# Altium schematic sheet PCB.SchDoc
size A4
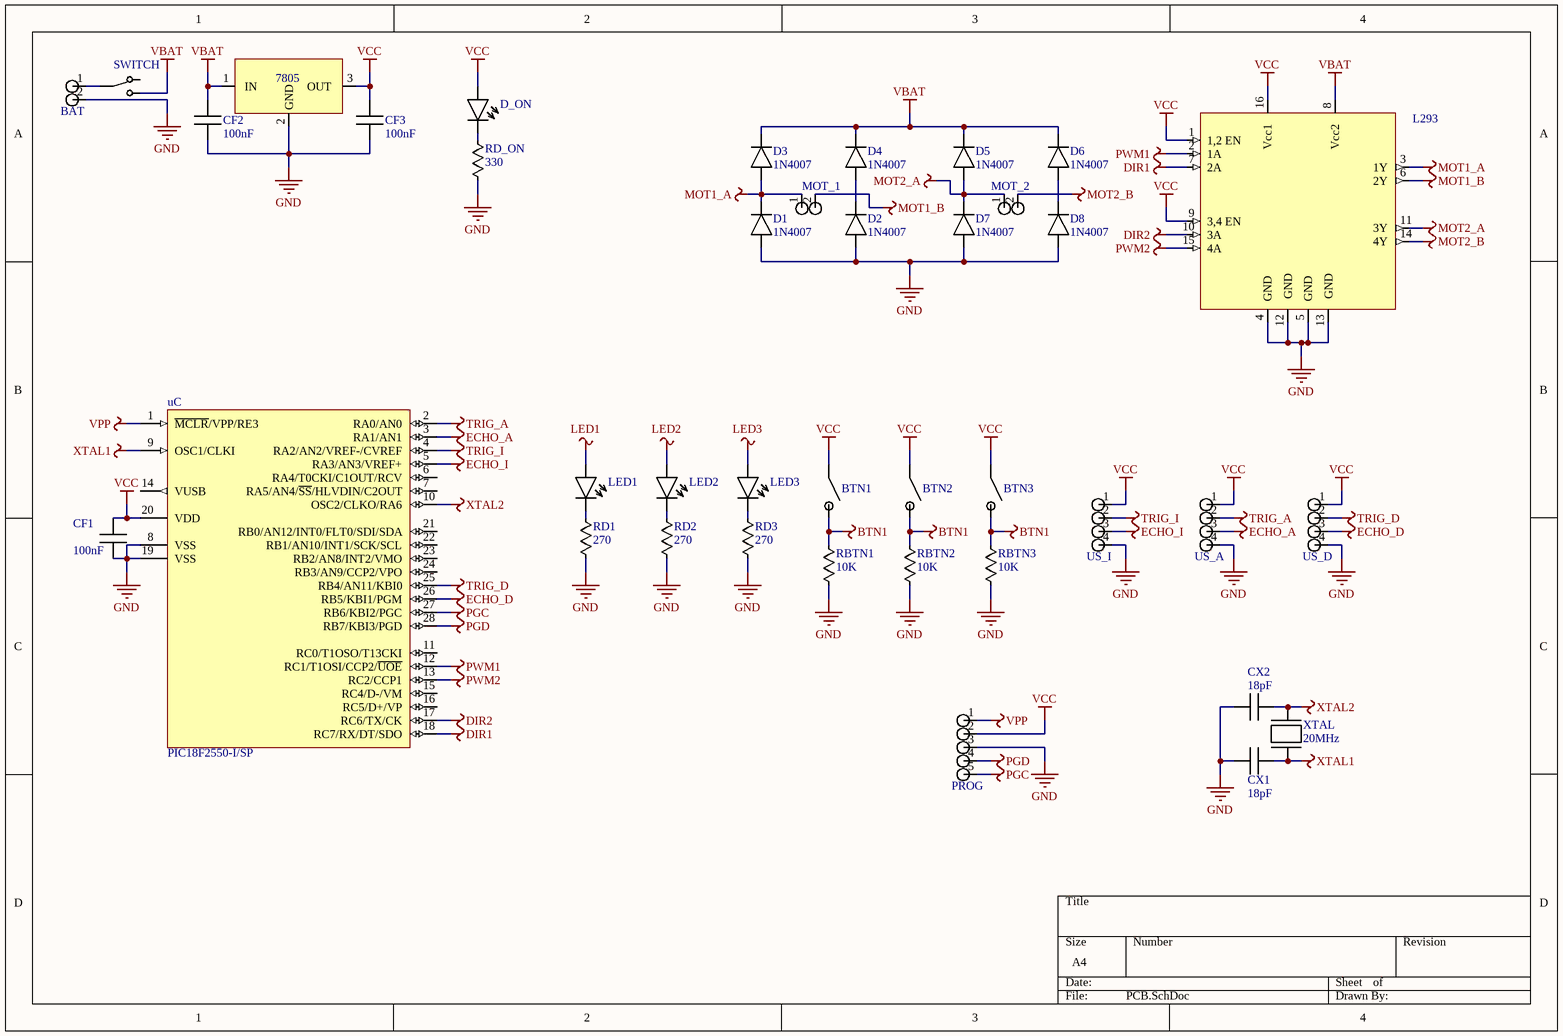
[diagram p0: PCB.SchDoc]

## Parts
7805  LM7805  [TO-220-STRAIGHT]  (value not drawn)
BAT  HEADER-2  [HEADER-2-VERTICAL]  (value not drawn)
BTN1  TACT_SWITCH-SMALL-4PIN  [TACT_SWITCH-SMALL-4PIN]  (value not drawn)
BTN2  TACT_SWITCH-SMALL-4PIN  [TACT_SWITCH-SMALL-4PIN]  (value not drawn)
BTN3  TACT_SWITCH-SMALL-4PIN  [TACT_SWITCH-SMALL-4PIN]  (value not drawn)
CF1  value 100nF  [CAP-CER]  (hidden comment: CAP-CER)
CF2  value 100nF  [CAP-CER]  (hidden comment: CAP-CER)
CF3  value 100nF  [CAP-CER]  (hidden comment: CAP-CER)
CX1  value 18pF  [CAP-CER]  (hidden comment: CAP-CER)
CX2  value 18pF  [CAP-CER]  (hidden comment: CAP-CER)
D1  NAME: 1N4007  [DO-41]  (hidden comment: DIODE)
D2  NAME: 1N4007  [DO-41]  (hidden comment: DIODE)
D3  NAME: 1N4007  [DO-41]  (hidden comment: DIODE)
D4  NAME: 1N4007  [DO-41]  (hidden comment: DIODE)
D5  NAME: 1N4007  [DO-41]  (hidden comment: DIODE)
D6  NAME: 1N4007  [DO-41]  (hidden comment: DIODE)
D7  NAME: 1N4007  [DO-41]  (hidden comment: DIODE)
D8  NAME: 1N4007  [DO-41]  (hidden comment: DIODE)
D_ON  LED  [LED-3MM-RED]  (value not drawn)
L293  L293  [DIP16]  (value not drawn)
LED1  LED  [LED-3MM-RED]  (value not drawn)
LED2  LED  [LED-3MM-YELLOW]  (value not drawn)
LED3  LED  [LED-3MM-GREEN]  (value not drawn)
MOT_1  HEADER-2  [HEADER-2-VERTICAL]  (value not drawn)
MOT_2  HEADER-2  [HEADER-2-VERTICAL]  (value not drawn)
PROG  HEADER-5  [HEADER-5-VERTICAL]  (value not drawn)
RBTN1  value 10K  [RES-Axial-400mil]  (hidden comment: RES)
RBTN2  value 10K  [RES-Axial-400mil]  (hidden comment: RES)
RBTN3  value 10K  [RES-Axial-400mil]  (hidden comment: RES)
RD1  value 270  [RES-Axial-400mil]  (hidden comment: RES)
RD2  value 270  [RES-Axial-400mil]  (hidden comment: RES)
RD3  value 270  [RES-Axial-400mil]  (hidden comment: RES)
RD_ON  value 330  [RES-Axial-400mil]  (hidden comment: RES)
SWITCH  SLIDE-SWITCH  [SWITCH]  (value not drawn)
uC  PIC18F2550-I/SP  [SPDIP300-SP28]
US_A  HEADER-4  [HEADER-4-VERTICAL]  (value not drawn)
US_D  HEADER-4  [HEADER-4-VERTICAL]  (value not drawn)
US_I  HEADER-4  [HEADER-4-VERTICAL]  (value not drawn)
XTAL  FREQUENCY: 20MHz  [HC-49/S]  (hidden comment: CRYSTAL-OSC)

## Nets
BTN1: BTN1.2 BTN2.2 BTN3.2 RBTN1.1 RBTN2.1 RBTN3.1
DIR1: L293.7(2A) uC.18(RC7/RX/DT/SDO)
DIR2: L293.10(3A) uC.17(RC6/TX/CK)
ECHO_A: uC.3(RA1/AN1) US_A.3
ECHO_D: uC.26(RB5/KBI1/PGM) US_D.3
ECHO_I: uC.5(RA3/AN3/VREF+) US_I.3
GND: 7805.2(GND) BAT.2 CF1.1 CF2.2 CF3.2 CX1.1 CX2.1 D1.A D2.A D7.A D8.A L293.4(GND) L293.5(GND) L293.12(GND) L293.13(GND) PROG.3 RBTN1.2 RBTN2.2 RBTN3.2 RD1.2 RD2.2 RD3.2 RD_ON.2 uC.8(VSS) uC.19(VSS) US_A.4 US_D.4 US_I.4
LED1: LED1.A
LED2: LED2.A
LED3: LED3.A
MOT1_A: D1.K D3.A L293.3(1Y) MOT_1.1
MOT1_B: L293.6(2Y) MOT_1.2
MOT2_A: D5.A D7.K L293.11(3Y) MOT_2.1
MOT2_B: L293.14(4Y) MOT_2.2
PGC: PROG.5 uC.27(RB6/KBI2/PGC)
PGD: PROG.4 uC.28(RB7/KBI3/PGD)
PWM1: L293.2(1A) uC.12(RC1/T1OSI/CCP2/~{UOE})
PWM2: L293.15(4A) uC.13(RC2/CCP1)
TRIG_A: uC.2(RA0/AN0) US_A.2
TRIG_D: uC.25(RB4/AN11/KBI0) US_D.2
TRIG_I: uC.4(RA2/AN2/VREF-/CVREF) US_I.2
VBAT: 7805.1(IN) CF2.1 D3.K D4.K D5.K D6.K L293.8(Vcc2) SWITCH.3
VCC: 7805.3(OUT) BTN1.1 BTN2.1 BTN3.1 CF1.2 CF3.1 D_ON.A L293.1(1,2_EN) L293.9(3,4_EN) L293.16(Vcc1) PROG.2 uC.20(VDD) US_A.1 US_D.1 US_I.1
VPP: PROG.1 uC.1(~{MCLR}/VPP/RE3)
XTAL1: CX1.2 uC.9(OSC1/CLKI) XTAL.1
XTAL2: CX2.2 uC.10(OSC2/CLKO/RA6) XTAL.2
NetBAT_1: BAT.1 SWITCH.2
NetD2_K: D2.K D4.A
NetD6_A: D6.A D8.K
NetD_ON_K: D_ON.K RD_ON.1
NetLED1_K: LED1.K RD1.1
NetLED2_K: LED2.K RD2.1
NetLED3_K: LED3.K RD3.1

Not connected (* = marked no-connect by the designer): SWITCH 1; uC 6(RA4/T0CKI/C1OUT/RCV) 7(RA5/AN4/~{SS}/HLVDIN/C2OUT) 11(RC0/T1OSO/T13CKI) 14(VUSB) 15(RC4/D-/VM) 16(RC5/D+/VP) 21(RB0/AN12/INT0/FLT0/SDI/SDA) 22(RB1/AN10/INT1/SCK/SCL) 23(RB2/AN8/INT2/VMO) 24(RB3/AN9/CCP2/VPO)

## Library data of the parts
uC = PIC18F2550-I/SP: High Performance, Enhanced Flash, USB Microcontroller with nanoWatt Technology, 32K Flash, 28-Pin SPDIP, Industrial Temperature Range; Published: 29-Jan-2009; LatestRevisionDate: 02-Dec-2009; LatestRevisionNote: Updated to datasheet revision E, Aug-2008; DatasheetVersion: revE, Aug-2008; PackageVersion: revBB, Aug-2009; PackageReference: SPDIP300-SP28; Publisher: Altium Limited; PackageDescription: 28-Lead Skinny Plastic Dual In-Line (SP) - 300 mil Body [SPDIP]; Supplier 1: Digi-Key; Supplier Part Number 1: PIC18F2550-I/SP-ND; Supplier 2: Farnell; Supplier Part Number 2: 9321250; Supplier 3: Farnell; Supplier Part Number 3: 1523822; ComponentLink1Description: Datasheet; ComponentLink1URL: http://ww1.microchip.com/downloads/en/DeviceDoc/39632e.pdf; ComponentLink2Description: Packaging Specification; ComponentLink2URL: http://www.microchip.com/stellent/groups/techpub_sg/documents/packagingspec/en012702.pdf; ComponentLink3Description: Microchip.com Home; ComponentLink3URL: http://www.microchip.com/